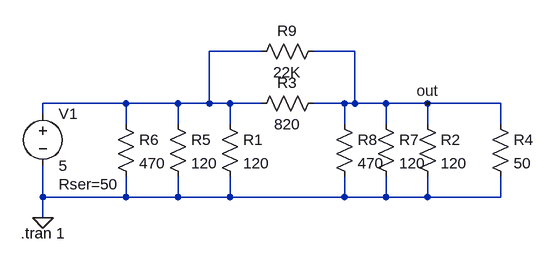
[diagram p0: schematic Draft3.asc]
Draft3.asc, the LTspice schematic file:
Version 4
SHEET 1 880 680
WIRE 192 -32 112 -32
WIRE 336 -32 272 -32
WIRE -16 48 -144 48
WIRE 64 48 -16 48
WIRE 112 48 112 -32
WIRE 112 48 64 48
WIRE 144 48 112 48
WIRE 192 48 144 48
WIRE 320 48 272 48
WIRE 336 48 336 -32
WIRE 336 48 320 48
WIRE 384 48 336 48
WIRE 448 48 384 48
WIRE 560 48 448 48
WIRE -144 64 -144 48
WIRE -16 80 -16 48
WIRE 64 80 64 48
WIRE 144 80 144 48
WIRE 320 80 320 48
WIRE 384 80 384 48
WIRE 448 80 448 48
WIRE 560 80 560 48
WIRE -144 192 -144 144
WIRE -16 192 -16 160
WIRE -16 192 -144 192
WIRE 64 192 64 160
WIRE 64 192 -16 192
WIRE 144 192 144 160
WIRE 144 192 64 192
WIRE 320 192 320 160
WIRE 320 192 144 192
WIRE 384 192 384 160
WIRE 384 192 320 192
WIRE 448 192 448 160
WIRE 448 192 384 192
WIRE 560 192 560 160
WIRE 560 192 448 192
WIRE -144 224 -144 192
FLAG -144 224 0
FLAG 448 48 out
SYMBOL res 128 64 R0
SYMATTR InstName R1
SYMATTR Value 120
SYMBOL res 432 64 R0
SYMATTR InstName R2
SYMATTR Value 120
SYMBOL res 288 32 R90
WINDOW 0 0 56 VBottom 2
WINDOW 3 32 56 VTop 2
SYMATTR InstName R3
SYMATTR Value 820
SYMBOL voltage -144 48 R0
WINDOW 123 0 0 Left 0
WINDOW 39 24 124 Left 2
SYMATTR InstName V1
SYMATTR Value 5
SYMATTR SpiceLine Rser=50
SYMBOL res 544 64 R0
SYMATTR InstName R4
SYMATTR Value 50
SYMBOL res 48 64 R0
SYMATTR InstName R5
SYMATTR Value 120
SYMBOL res -32 64 R0
SYMATTR InstName R6
SYMATTR Value 470
SYMBOL res 368 64 R0
SYMATTR InstName R7
SYMATTR Value 120
SYMBOL res 304 64 R0
SYMATTR InstName R8
SYMATTR Value 470
SYMBOL res 288 -48 R90
WINDOW 0 0 56 VBottom 2
WINDOW 3 32 56 VTop 2
SYMATTR InstName R9
SYMATTR Value 22K
TEXT -178 248 Left 2 !.tran 1

The netlist it stands for:
* Draft3.asc
R1 N001 0 120
R2 out 0 120
R3 out N001 820
V1 N001 0 5 Rser=50
R4 out 0 50
R5 N001 0 120
R6 N001 0 470
R7 out 0 120
R8 out 0 470
R9 out N001 22K
.tran 1
.backanno
.end